# Altium schematic sheet 05-General I2C Devices.SchDoc
size A3; SheetNumber: 5; SheetTotal: 12
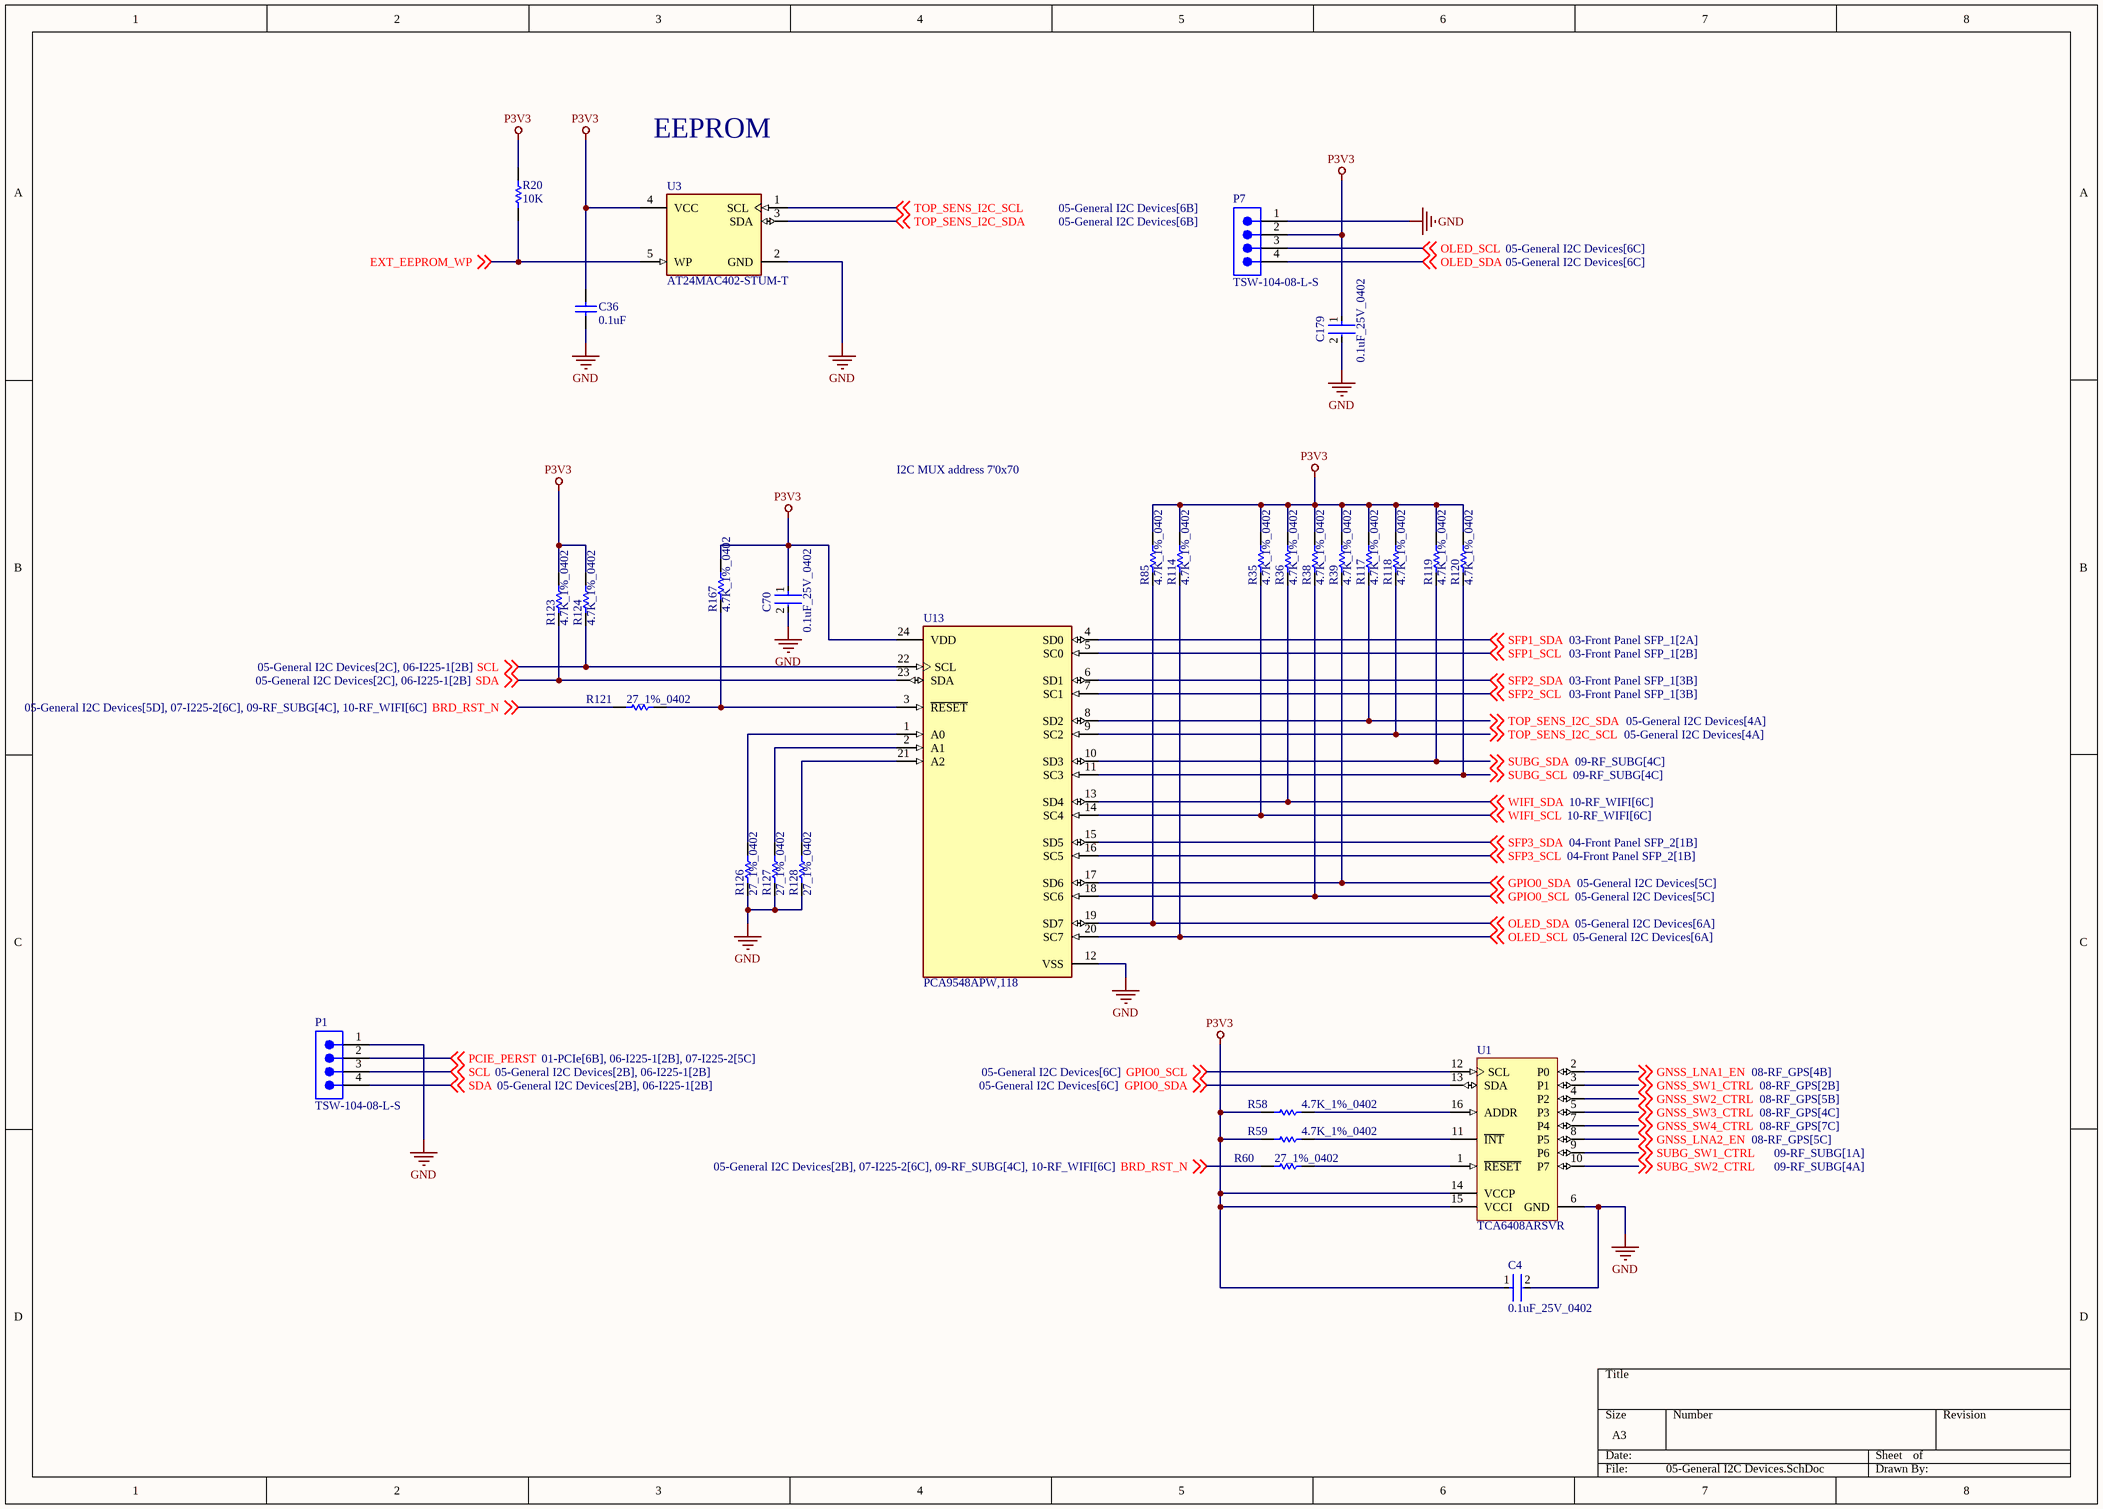
[diagram p0: 05-General I2C Devices.SchDoc]

## Parts
C4  0.1uF_25V_0402  [FP-0402-L_1_0_1-W_0_5_0_1-IPC_C]
C36  0.1uF  [CAPC1608X87X45ML20T05]
C70  0.1uF_25V_0402  [FP-0402-L_1_0_1-W_0_5_0_1-IPC_C]
C179  0.1uF_25V_0402  [FP-0402-L_1_0_1-W_0_5_0_1-IPC_C]
P1  TSW-104-08-L-S  [SMTC-TSW-104-08-X-S]
P7  TSW-104-08-L-S  [SMTC-TSW-104-08-X-S]
R20  10K  [RESC1608X55X30LL15T20]
R35  4.7K_1%_0402  [RESC1005X40X25NL10T10]
R36  4.7K_1%_0402  [RESC1005X40X25NL10T10]
R38  4.7K_1%_0402  [RESC1005X40X25NL10T10]
R39  4.7K_1%_0402  [RESC1005X40X25NL10T10]
R58  4.7K_1%_0402  [RESC1005X40X25NL10T10]
R59  4.7K_1%_0402  [RESC1005X40X25NL10T10]
R60  27_1%_0402  [RESC1005X40X25NL05T05]
R85  4.7K_1%_0402  [RESC1005X40X25NL10T10]
R114  4.7K_1%_0402  [RESC1005X40X25NL10T10]
R117  4.7K_1%_0402  [RESC1005X40X25NL10T10]
R118  4.7K_1%_0402  [RESC1005X40X25NL10T10]
R119  4.7K_1%_0402  [RESC1005X40X25NL10T10]
R120  4.7K_1%_0402  [RESC1005X40X25NL10T10]
R121  27_1%_0402  [RESC1005X40X25NL05T05]
R123  4.7K_1%_0402  [RESC1005X40X25NL10T10]
R124  4.7K_1%_0402  [RESC1005X40X25NL10T10]
R126  27_1%_0402  [RESC1005X40X25NL05T05]
R127  27_1%_0402  [RESC1005X40X25NL05T05]
R128  27_1%_0402  [RESC1005X40X25NL05T05]
R167  4.7K_1%_0402  [RESC1005X40X25NL10T10]
U1  TCA6408ARSVR  [RSV0016A_V]
U3  AT24MAC402-STUM-T  [FP-5TS1-IPC_C]
U13  PCA9548APW,118  [FP-SOT355-1-MFG]

## Nets
GND: C4.2 C36.1 C70.2 C179.2 P1.1 P7.1 R126.1 R127.1 R128.1 U1.6(GND) U3.2(GND) U13.12(VSS)
P3V3: C4.1 C36.2 C70.1 C179.1 P7.2 R20.2 R35.2 R36.2 R38.2 R39.2 R58.2 R59.2 R85.2 R114.2 R117.2 R118.2 R119.2 R120.2 R123.2 R124.2 R167.2 U1.14(VCCP) U1.15(VCCI) U3.4(VCC) U13.24(VDD)
BRD_RST_N: R60.1 R121.1 ; off-sheet BRD_RST_N
EXT_EEPROM_WP: R20.1 U3.5(WP) ; off-sheet EXT_EEPROM_WP
GNSS_LNA1_EN: U1.2(P0) ; off-sheet GNSS_LNA1_EN
GNSS_LNA2_EN: U1.8(P5) ; off-sheet GNSS_LNA2_EN
GNSS_SW1_CTRL: U1.3(P1) ; off-sheet GNSS_SW1_CTRL
GNSS_SW2_CTRL: U1.4(P2) ; off-sheet GNSS_SW2_CTRL
GNSS_SW3_CTRL: U1.5(P3) ; off-sheet GNSS_SW3_CTRL
GNSS_SW4_CTRL: U1.7(P4) ; off-sheet GNSS_SW4_CTRL
GPIO0_SCL: R38.1 U1.12(SCL) U13.18(SC6) ; off-sheet GPIO0_SCL
GPIO0_SDA: R39.1 U1.13(SDA) U13.17(SD6) ; off-sheet GPIO0_SDA
OLED_SCL: P7.3 R114.1 U13.20(SC7) ; off-sheet OLED_SCL
OLED_SDA: P7.4 R85.1 U13.19(SD7) ; off-sheet OLED_SDA
PCIE_PERST: P1.2 ; off-sheet PCIE_PERST
SCL: P1.3 R124.1 U13.22(SCL) ; off-sheet SCL
SDA: P1.4 R123.1 U13.23(SDA) ; off-sheet SDA
SFP1_SCL: U13.5(SC0) ; off-sheet SFP1_SCL
SFP1_SDA: U13.4(SD0) ; off-sheet SFP1_SDA
SFP2_SCL: U13.7(SC1) ; off-sheet SFP2_SCL
SFP2_SDA: U13.6(SD1) ; off-sheet SFP2_SDA
SFP3_SCL: U13.16(SC5) ; off-sheet SFP3_SCL
SFP3_SDA: U13.15(SD5) ; off-sheet SFP3_SDA
SUBG_SCL: R120.1 U13.11(SC3) ; off-sheet SUBG_SCL
SUBG_SDA: R119.1 U13.10(SD3) ; off-sheet SUBG_SDA
SUBG_SW1_CTRL: U1.9(P6) ; off-sheet SUBG_SW1_CTRL
SUBG_SW2_CTRL: U1.10(P7) ; off-sheet SUBG_SW2_CTRL
TOP_SENS_I2C_SCL: R118.1 U3.1(SCL) U13.9(SC2) ; off-sheet TOP_SENS_I2C_SCL
TOP_SENS_I2C_SDA: R117.1 U3.3(SDA) U13.8(SD2) ; off-sheet TOP_SENS_I2C_SDA
WIFI_SCL: R35.1 U13.14(SC4) ; off-sheet WIFI_SCL
WIFI_SDA: R36.1 U13.13(SD4) ; off-sheet WIFI_SDA
NetR58_1: R58.1 U1.16(ADDR)
NetR59_1: R59.1 U1.11(~{INT})
NetR60_2: R60.2 U1.1(~{RESET})
NetR121_2: R121.2 R167.1 U13.3(~{RESET})
NetR126_2: R126.2 U13.1(A0)
NetR127_2: R127.2 U13.2(A1)
NetR128_2: R128.2 U13.21(A2)

## Notes on the sheet
- EEPROM
- I2C MUX address 7'0x70

## Library data of the parts
C4 C70 C179 = CMP-2008-02519-2: General Purpose Ceramic Capacitor, 0402, 100nF, 10%, X7R, 15%, 25V; Package Quantity: 1; Capacitance: 100nF; Min Operating Temperature: -55°C; Voltage: 25V; Voltage Rating: 25V; Construction: Flat; Max Operating Temperature: 125°C; Radiation Hardening: No; Depth: 0.5mm; Thickness: 0.022inch; Voltage Rating (DC): 25V; Number of Pins: 2; Lead Free: Lead Free; Series: -; REACH SVHC: No SVHC; Length: 1mm; Dielectric: X7R; RoHS Compliant: Yes; Mount: Surface Mount; Packaging: Tape and Reel; Case/Package: 0402; Case Code (Imperial): 0402; Termination: SMD/SMT; Width: 0.02inch; Case Code (Metric): 1005; Tolerance: 10%
C36 = CMP-2006-00003-1: C0603X104K5RACAUTO; Manufacturer: Kemet; Part Number: C0603X104K5RACAUTO
P1 P7 = CMP-1024-00358-1: 0.025" SQ Post Header, Through-hole, Vertical, -55 to 125 degC, 2.54 mm Pitch, 4-Pin, Male, RoHS; Manufacturer: Samtec; Pitch: 2.54 mm; PartNumber: TSW-104-08-L-S; RoHS: True; Temperature Range: -55 to 125 degC; PackageDescription: .025[0.64] SQ. Post Terminal Strip Assembly; Orientation: Vertical; ComponentLink2URL: http://www.samtec.com/documents/webfiles/pdf/TSW_TH.PDF; ComponentLink1Description: Manufacturer URL; ComponentLink2Description: Datasheet; PackageVersion: DM, 8/1988; ComponentLink3URL: http://www.samtec.com/documents/webfiles/cpdf/TSW-XXX-XX-XXX-X-XX-XXX-MKT.pdf; Mounting Technology: Through-hole; PackageReference: TSW-104-08-X-S; ComponentLink3Description: Package Specification; ComponentLink1URL: http://www.samtec.com; DatasheetVersion: F-214
R20 = CMP-2000-06990-1: Chip Resistor, 10 KOhm, +/- 1%, 0.1 W, -55 to 155 degC, 0603 (1608 Metric), RoHS, Tape and Reel RMCF0603FT10K0; Manufacturer: Stackpole-Electronics-Inc.; Temperature Coefficient: ±100ppm/°C; Power (Watts): 0.1W,1/10W; Package / Case: 0603(1608Metric); Datasheet Version: 01/2017; Resistance (Ohms): 10k; Features: AutomotiveAEC-Q200; Packaging: CutTape(CT); Series: RMCF; Height: 0.022"(0.55mm); Tolerance: ±1%; Manufacturer URL: https://www.seielect.com/; Datasheet URL: https://www.seielect.com/Catalog/SEI-RMCF_RMCP.pdf; Supplier Device Package: 0603; Number of Terminations: 2; Family: ChipResistor-SurfaceMount; Package Reference: 0603; Size / Dimension: 0.061"Lx0.031"W(1.55mmx0.80mm); Mounting Technology: SurfaceMount; Package Description: 2-Pin Surface Mount Device, Body 1.55 x 0.8 mm; Operating Temperature: -55°C~155°C; Composition: ThickFilm; Category: Resistors
R35 R36 R38 R39 R58 R59 R85 R114 R117-R120 R123 R124 R167 = CMP-2002-05217-1: Manufacturer: Bourns; Part Number: CR0402-FX-4701GLF
R60 R121 R126-R128 = CMP-2002-08434-1: Part Number: CRCW040227R0FKED; Manufacturer: Vishay Dale
U1 = CMP-0314-00021-2: Low-Voltage 8-Bit I2C and SMBus I/O Expander, 1.65 to 5.5 V, -40 to 85 degC, 16-pin UQFN (RSV), Green (RoHS & no Sb/Br); Manufacturer: Texas Instruments; Configuration Registers: Yes; Max Frequency(kHz): 400; # of I/Os: 8; SubFamily: I2C IO Expander; I2C Address: 0100 00x; VCC(Min)(V): 1.65; VCC(Max)(V): 5.5; Reset Input: Yes; ComponentLink2URL: http://www.ti.com/litv/pdf/mpqf115g; PackageVersion: revD, Dec-2011; No. of Outputs: 8; PackageReference: RSV0016A; DatasheetVersion: SCPS192C; fSCLK(Max)(MHz): 400; Mounting Technology: Surface Mount; ComponentLink1Description: Datasheet; Push-Pull I/O Type: Yes; Code_JEDEC: MO-288*; PackageDescription: 16-Leads Plastic Quad Flatpack No-Lead, 2.6 x 1.8 x 0.5 mm Body, 0.4 mm Pitch; ComponentLink1URL: http://www.ti.com/general/docs/lit/getliterature.tsp?genericPartNumber=TCA6408A&fileType=pdf; Interrupt Output: Yes; PartNumber: TCA6408ARSVR; Eco-Plan: Green (RoHS & no Sb/Br); Low Power: Yes; Vcc range(V): 1.65 to 5.5; ComponentLink2Description: Package Specification; 5V Tolerant I/O: Yes
U3 = CMP-06313-000011-1: IC EEPROM 2K I2C 1MHZ SOT23-5; Manufacturer: Microchip; Memory Size: 2Kbits; Min Supply Voltage: 1.7V; Max Supply Voltage: 5.5V; Frequency: 1000kHz; Standoff Height: 0mm; Nominal Supply Current: 0.4-2mA; Access Time: 0.55us; Interface: I2C,2-Wire; Temperature Range Low: -40°C; Height: 1mm; ComponentLink2URL: http://ww1.microchip.com/downloads/en/DeviceDoc/Atmel-8807-SEEPROM-AT24MAC402-602-Datasheet.pdf; Ipc Land Pattern Name: SOT95P280X100-5; Category: IC; Memory Type: EEPROM; Digikey Description: IC EEPROM 2K I2C 1MHZ SOT23-5; Manufacturer Part Number: AT24MAC402-STUM-T; Device Class L1: Integrated Circuits (ICs); Temperature Range High: +85°C; ComponentLink2Description: Datasheet; RoHS: TRUE; Mouser Description: EEPROM Serial-I2C 2K-bit 256 x 8 1.8V/2.5V/3.3V/5V 5-Pin SOT-23 T/R; Octopart: https://octopart.com/at24mac402-stum-t-microchip-77758112; Temperature: -40°C to +85°C; Package: 5TS1; Device Class L3: EEPROM; Automotive: No; Device Class L2: Memory; Lead Free: Yes
U13 = CMP-2000-06880-2: IC INTERFACE SPECIALIZED 24TSSOP; Power Dissipation: 400mW; Low Level Output Current: 9mA; Number of Channels: 16; Max Frequency: 400kHz; Number of Inputs: 8; Number of Outputs: 1; On-State Resistance: 24R; Interface: I2C; Turn-On Delay Time: 300ns; Logic Function: Multiplexer; Nominal Supply Current: 100mA; Operating Supply Current: 65uA; Min Supply Voltage: 2.3V; Propagation Delay: 0.3ns; Max Supply Voltage: 5.5V; Contact Plating: Gold; Max Power Dissipation: 400mW; Mount: Surface Mount; Package Quantity: 2500; Min Operating Temperature: -40°C; Max Operating Temperature: 85°C; Case/Package: TSSOP; Number of Pins: 24; Bandwidth: 400kHz; Quiescent Current: 65uA; Packaging: Tape and Reel; Lead Free: Lead Free; Turn-Off Delay Time: 300ns; Radiation Hardening: No